# Altium schematic sheet RP_ComputeModule3_rev.3.0_BootSelector.SchDoc
size A4 portrait
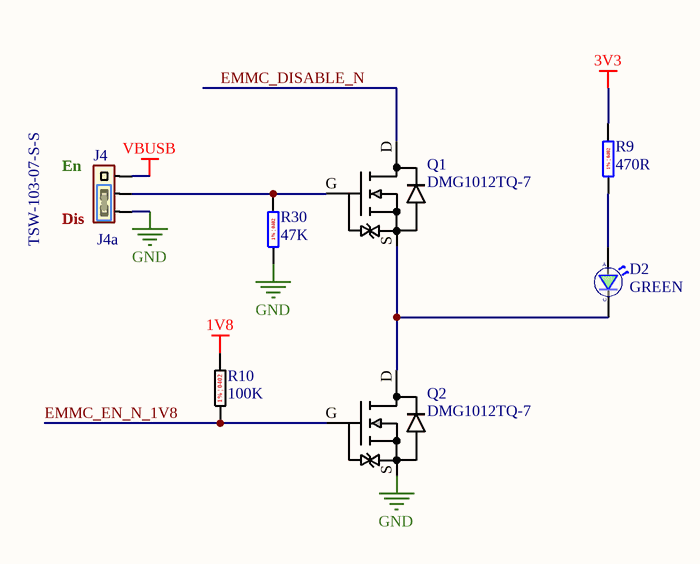
[diagram p0: RP_ComputeModule3_rev.3.0_BootSelector.SchDoc]

## Parts
D2  GREEN  [ROHM 0603 LED]
J4  TSW-103-07-S-S  [Samtec TSW-103-07-S-S]
J4a  Jumper  [Kobiconn 151-8011-E (Blue)]  (value not drawn)
Q1  DMG1012TQ-7  [Diodes SOT523]
Q2  DMG1012TQ-7  [Diodes SOT523]
R9  470R  [Vishay RES0402]
R10  100K  [RES0402]
R30  47K  [Vishay Beyschlag MCS0402]

## Nets
1V8: R10.1
3V3: R9.1
GND: J4.1 Q2.S R30.2
VBUSB: J4.3
EMMC_DISABLE_N: Q1.D
EMMC_EN_N_1V8: Q2.G R10.2
NetD2_A: D2.A R9.2
NetD2_C: D2.C Q1.S Q2.D
NetJ4_2: J4.2 Q1.G R30.1

## Notes on the sheet
- En
- Dis
- (in symbol MCS04020C4700FE000) 1% | 0402
- (in symbol MCS04020C4702FE000) 1% | 0402
- (in symbol SG73P1ETTP1003F) 1% | 0402

## Library data of the parts
D2 = SML-D12M8WT86: LED GREEN DIFFUSED 0603 SMD; Manufacturer: Rohm; Colour: Green,Yellow; Lens Colour: White,Clear,Diffused; Lens Style: Diffused,Colorless,Rectangular; Forward Current: 20mA; Forward Voltage: 2.2V; Luminous Intensity: 25mcd; Dominant Wavelength: 572nm; Number of LEDs: 1; Viewing Angle: 160°; Supplier 1: Mouser; Manufacturer Part Number: SML-D12M8WT86; Stock 1: 109326; Pricing 1: 1=0.32, 10=0.216, 50=0.216, 100=0.09, 1000=0.062, 10000=0.041 (USD); Mount: Surface Mount; Case/Package: 0603; Number of Pins: 2; Case Code (Metric): 1608; Case Code (Imperial): 0603; Min Operating Temperature: -40°C; Max Operating Temperature: 85°C; Packaging: Tape and Reel; Wavelength: 572nm; Illumination Colour: Green; Package Quantity: 1; Test Current: 20mA; Lens Transparency: Diffused; Length: 1.6mm; Height: 0.65mm; Width: 0.8mm; Radiation Hardening: No; REACH SVHC: Unknown; Lead Free: Lead Free; ComponentLink1URL: https://datasheet.ciiva.com/11774/0900766b80df3ada-11774260.pdf; ComponentLink1Description: https://datasheet.ciiva.com/11774/0900766b80df3ada-11774260.pdf; ComponentLink2URL: https://datasheet.ciiva.com/3161/sml-d1-3161419.pdf; ComponentLink2Description: https://datasheet.ciiva.com/3161/sml-d1-3161419.pdf; ComponentLink3URL: https://datasheet.ciiva.com/2110/sml-d1-2110396.pdf; ComponentLink3Description: https://datasheet.ciiva.com/2110/sml-d1-2110396.pdf; ComponentLink4URL: https://datasheet.ciiva.com/2110/sml-d1-2110397.pdf; ComponentLink4Description: https://datasheet.ciiva.com/2110/sml-d1-2110397.pdf; ComponentLink5URL: https://datasheet.ciiva.com/2110/sml-d1-2110398.pdf; ComponentLink5Description: https://datasheet.ciiva.com/2110/sml-d1-2110398.pdf
J4 = TSW-103-07-S-S: Conn Unshrouded Header HDR 3 POS 2.54mm Solder ST Thru-Hole Bulk; Manufacturer: Samtec; Number of Contacts: 3; Gender: Male; Max Current Rating: 7.6A; Max Voltage Rating (AC): 550V; Connector Type: Male Pin; Supplier 1: Digi-Key; Manufacturer Part Number: TSW-103-07-S-S; Stock 1: 950; Pricing 1: 1=1.22, 10=1.089, 100=0.8965, 500=0.70868, 1000=0.60836, 5000=0.555, 10000=0.53365 (USD); Mount: Through Hole; Contact Plating: Nickel,Gold; Contact Material: Bronze; Housing Colour: Black; Housing Material: Polyester; Colour: Black; Min Operating Temperature: -55°C; Max Operating Temperature: 125°C; Number of Rows: 1; Termination: Solder; Packaging: Bulk; Orientation: Straight; Number of Positions: 3; Package Quantity: 1; Length: 7.62mm; Pitch: 2.54mm; Depth: 2.54mm; Contact Mating Length: 0.23inch; Width: 2.54mm; Radiation Hardening: No; REACH SVHC: No SVHC; Lead Free: Lead Free; ComponentLink1URL: https://datasheet.ciiva.com/16733/htsw-th-16733894.pdf; ComponentLink1Description: https://datasheet.ciiva.com/16733/htsw-th-16733894.pdf; ComponentLink2URL: https://datasheet.ciiva.com/48561/htsw-th-48561433.pdf; ComponentLink2Description: https://datasheet.ciiva.com/48561/htsw-th-48561433.pdf; ComponentLink3URL: https://datasheet.ciiva.com/6887/tsw-xxx-xx-xxx-x-xx-xxx-mkt-6887228.pdf; ComponentLink3Description: https://datasheet.ciiva.com/6887/tsw-xxx-xx-xxx-x-xx-xxx-mkt-6887228.pdf
J4a = 151-8011-E: Headers & Wire Housings MINI JUMPER GF 6.0MM CLOSE TYPE BLUE; Manufacturer: Kobiconn; Number of Positions: 2; Pitch: 2.54mm; Supplier 1: Mouser; Manufacturer Part Number: 151-8011-E; Stock 1: 0; Contact Gender: Male; Package Quantity: 2000; ComponentLink1URL: https://datasheet.ciiva.com/5162/kc-301174-5162989.pdf; ComponentLink1Description: https://datasheet.ciiva.com/5162/kc-301174-5162989.pdf
Q1 Q2 = DMG1012TQ-7: MOSFET NCH 20V 630MA SOT523; Manufacturer: Diodes; Rds On Max: 400mR; Input Capacitance: 60.67pF; Max Power Dissipation: 280mW; Supplier 1: Mouser; Manufacturer Part Number: DMG1012TQ-7; Stock 1: 11314; Pricing 1: 1=0.34, 10=0.225, 50=0.225, 100=0.094, 1000=0.064, 10000=0.043 (USD); Mount: Surface Mount; Case/Package: SOT-523; Number of Pins: 3; Min Operating Temperature: -55°C; Max Operating Temperature: 150°C; Packaging: Tape and Reel; Drain to Source Voltage (Vdss): 20V; Continuous Drain Current (ID): 630mA; ComponentLink1URL: http://www.mouser.com/ds/2/115/ds31783-892575.pdf; ComponentLink1Description: http://www.mouser.com/ds/2/115/ds31783-892575.pdf; ComponentLink2URL: https://www.diodes.com/assets/Datasheets/ds31783.pdf; ComponentLink2Description: https://www.diodes.com/assets/Datasheets/ds31783.pdf
R9 = MCS04020C4700FE000: RES SMD 470 OHM 1% 1/10W 0402; Manufacturer: Vishay BCcomponents; Temperature Coefficient: 50ppm/°C; Max Power Dissipation: 100mW; Supplier 1: Digi-Key; Manufacturer Part Number: MCS04020C4700FE000; Stock 1: 98990; Pricing 1: 1=0.3, 10=0.254, 100=0.0993, 1000=0.04158, 2500=0.03812, 5000=0.03465 (USD); Case/Package: 0402; Contact Plating: Tin; Min Operating Temperature: -55°C; Max Operating Temperature: 125°C; Resistance: 470R; Tolerance: 1%; Composition: Thin Film; Packaging: Tape and Reel; Package Quantity: 10000; Number of Terminations: 2; Military Standard: Not; Length: 0.039inch; Height: 0.015inch; Width: 0.02inch; Depth: 0.5mm; Radiation Hardening: No; Lead Free: Lead Free; ComponentLink1URL: https://datasheet.ciiva.com/16892/mc-pro-16892843.pdf; ComponentLink1Description: https://datasheet.ciiva.com/16892/mc-pro-16892843.pdf; ComponentLink2URL: https://datasheet.ciiva.com/2569/mc-pro-2569740.pdf; ComponentLink2Description: https://datasheet.ciiva.com/2569/mc-pro-2569740.pdf; ComponentLink3URL: https://datasheet.ciiva.com/8901/mc-pro-8901326.pdf; ComponentLink3Description: https://datasheet.ciiva.com/8901/mc-pro-8901326.pdf
R10 = SG73P1ETTP1003F: Thick Film Resistors - SMD 0.125W 100Kohm 1% 200ppm; Manufacturer: KOA Speer; Resistance: 100kR; Power Rating: 125mW; Voltage Rating: 200V; Temperature Coefficient: 200ppm/°C; Voltage Rating (DC): 50V; Supplier 1: Mouser; Manufacturer Part Number: SG73P1ETTP1003F; Stock 1: 17094; Pricing 1: 1=0.24, 10=0.24, 50=0.053, 100=0.041, 1000=0.03, 10000=0.018 (USD); Case/Package: 0402; Case Code (Imperial): 0402; Case Code (Metric): 1005; Min Operating Temperature: -55°C; Max Operating Temperature: 155°C; Tolerance: 1%; Packaging: Tape and Reel; Termination: SMD/SMT; ComponentLink1URL: https://datasheet.ciiva.com/5567/sg73-5567782.pdf; ComponentLink1Description: https://datasheet.ciiva.com/5567/sg73-5567782.pdf
R30 = MCS04020C4702FE000: Res Thin Film 0402 47K Ohm 1% 1/16W ±50ppm/C Molded SMD Paper T/R; Manufacturer: Vishay BCcomponents; Resistance: 47kR; Temperature Coefficient: 50ppm/°C; Power Rating: 100mW; Voltage Rating: 50V; Supplier 1: Mouser; Manufacturer Part Number: MCS04020C4702FE000; Stock 1: 7724; Pricing 1: 1=0.11, 10=0.11, 50=0.076, 100=0.065, 1000=0.054, 10000=0.04 (USD); Case/Package: 0402; Contact Plating: Tin; Case Code (Metric): 1005; Case Code (Imperial): 0402; Min Operating Temperature: -55°C; Max Operating Temperature: 125°C; Tolerance: 1%; Composition: Thin Film; Packaging: Tape and Reel; Military Standard: Not; Voltage Rating (DC): 50V; Length: 1mm; Depth: 0.5mm; Width: 500um; Radiation Hardening: No; REACH SVHC: No SVHC; Lead Free: Lead Free; ComponentLink1URL: https://datasheet.ciiva.com/17178/mc-pro-17178488.pdf; ComponentLink1Description: https://datasheet.ciiva.com/17178/mc-pro-17178488.pdf; ComponentLink2URL: https://datasheet.ciiva.com/8900/mc-pro-8900138.pdf; ComponentLink2Description: https://datasheet.ciiva.com/8900/mc-pro-8900138.pdf